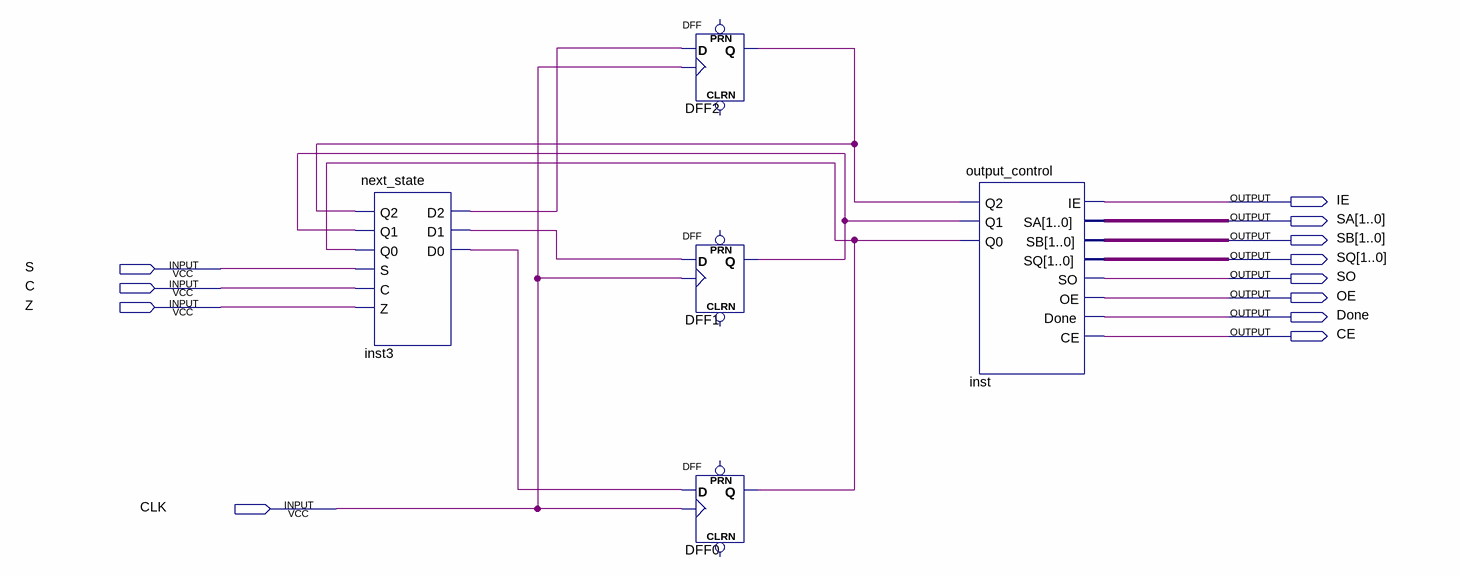
[diagram p0: schematic sheet]
// Quartus schematic Control.bdf as structural Verilog: 5 symbols, 12 pins
module Control (
  input  S,
  input  C,
  input  Z,
  input  CLK,
  output IE,
  output [1:0] SA,
  output [1:0] SB,
  output [1:0] SQ,
  output SO,
  output OE,
  output Done,
  output CE
);

  wire DFF0_q, DFF1_q, DFF2_q, inst3_d0, inst3_d1, inst3_d2;

  next_state inst3 (
    .Q2(DFF2_q), .Q1(DFF1_q), .Q0(DFF0_q), .S(S), .C(C), .Z(Z), .D2(inst3_d2), .D1(inst3_d1), .D0(inst3_d0));
  DFF DFF2 (.CLK(CLK), .D(inst3_d2), .Q(DFF2_q));  // open: CLRN, PRN
  DFF DFF1 (.CLK(CLK), .D(inst3_d1), .Q(DFF1_q));  // open: CLRN, PRN
  DFF DFF0 (.CLK(CLK), .D(inst3_d0), .Q(DFF0_q));  // open: CLRN, PRN
  output_control inst (
    .Q2(DFF2_q), .Q1(DFF1_q), .Q0(DFF0_q), .IE(IE), .SA(SA), .SB(SB), .SQ(SQ), .SO(SO), .OE(OE), .Done(Done),
    .CE(CE));
endmodule
